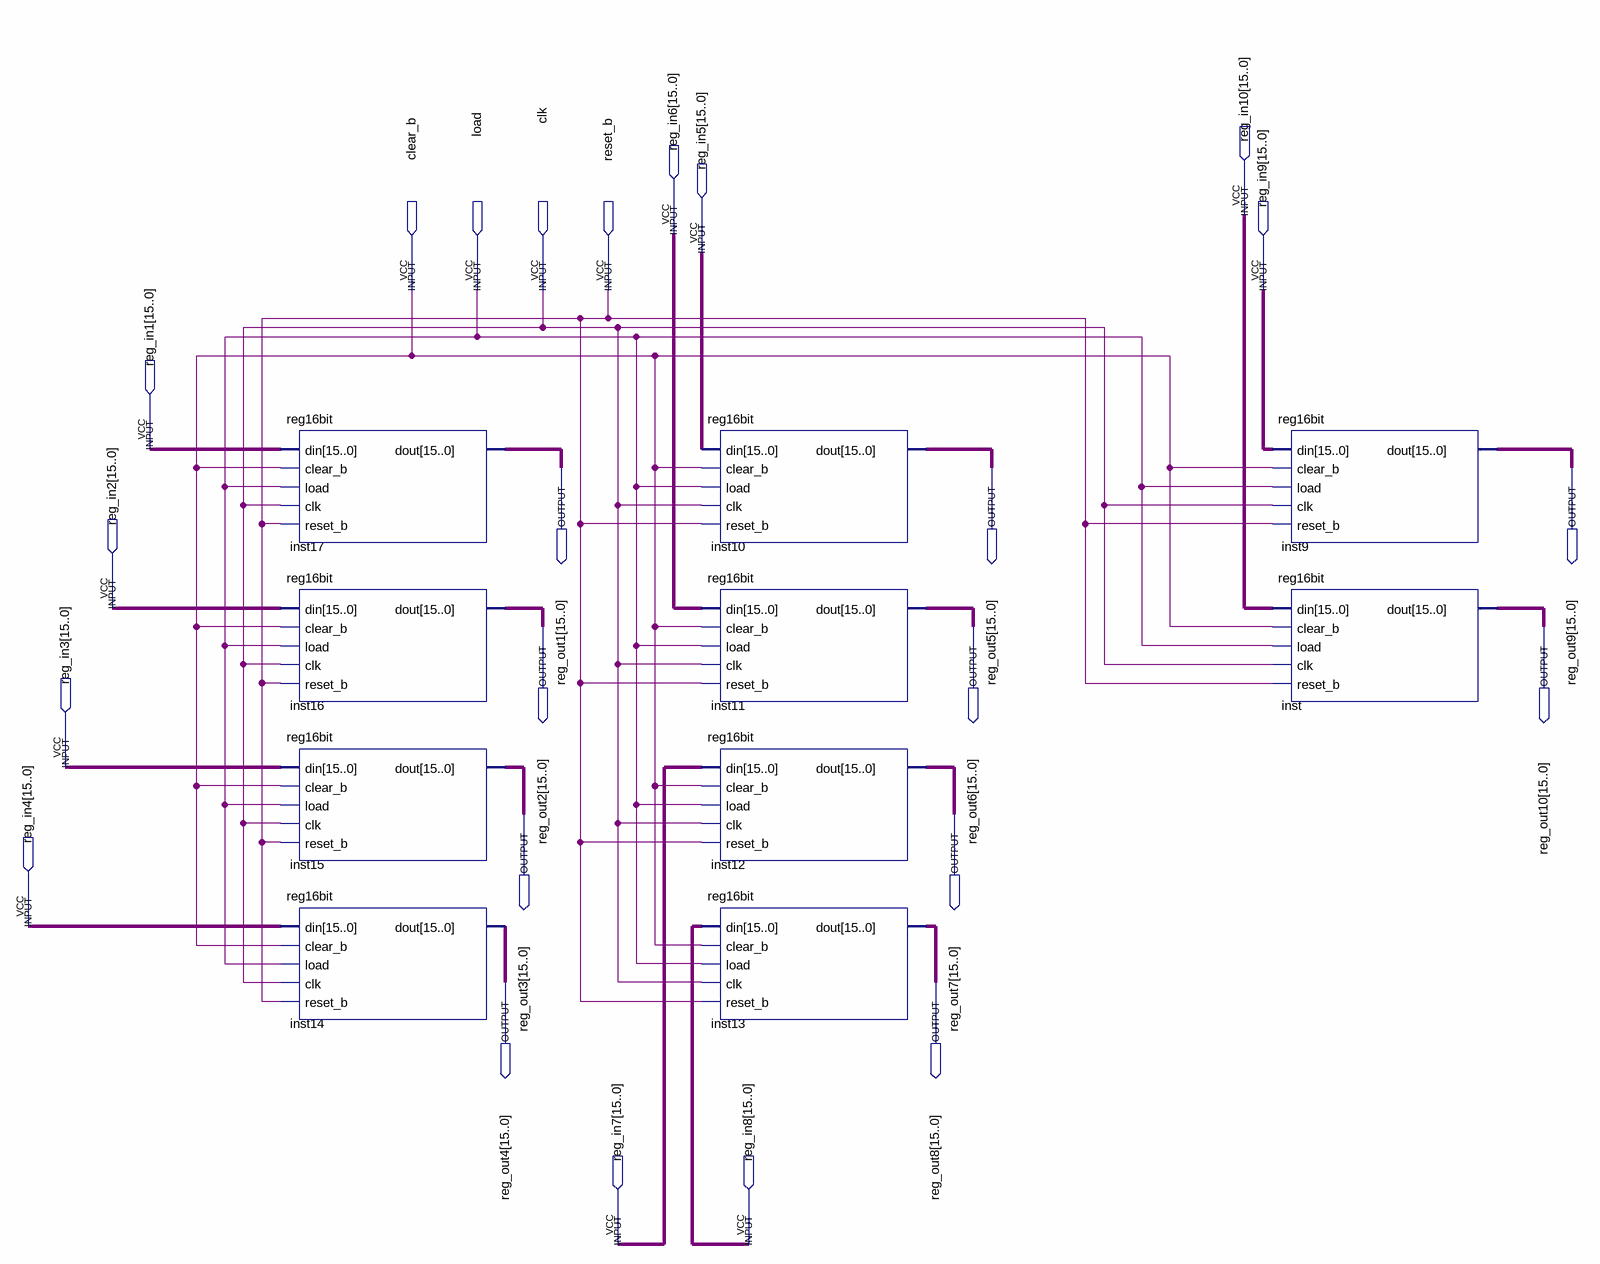
[diagram p0: schematic sheet]
// Quartus schematic reg160bitFinal.bdf as structural Verilog: 10 symbols, 24 pins
module reg160bitFinal (
  input  [15:0] reg_in10,
  input  [15:0] reg_in6,
  input  [15:0] reg_in5,
  input  clear_b,
  input  load,
  input  clk,
  input  reset_b,
  input  [15:0] reg_in9,
  input  [15:0] reg_in1,
  input  [15:0] reg_in2,
  input  [15:0] reg_in3,
  input  [15:0] reg_in4,
  input  [15:0] reg_in7,
  input  [15:0] reg_in8,
  output [15:0] reg_out1,
  output [15:0] reg_out5,
  output [15:0] reg_out9,
  output [15:0] reg_out2,
  output [15:0] reg_out6,
  output [15:0] reg_out10,
  output [15:0] reg_out3,
  output [15:0] reg_out7,
  output [15:0] reg_out4,
  output [15:0] reg_out8
);

  reg16bit inst17 (.din(reg_in1), .clear_b(clear_b), .load(load), .clk(clk), .reset_b(reset_b), .dout(reg_out1));
  reg16bit inst16 (.din(reg_in2), .clear_b(clear_b), .load(load), .clk(clk), .reset_b(reset_b), .dout(reg_out2));
  reg16bit inst15 (.din(reg_in3), .clear_b(clear_b), .load(load), .clk(clk), .reset_b(reset_b), .dout(reg_out3));
  reg16bit inst14 (.din(reg_in4), .clear_b(clear_b), .load(load), .clk(clk), .reset_b(reset_b), .dout(reg_out4));
  reg16bit inst10 (.din(reg_in5), .clear_b(clear_b), .load(load), .clk(clk), .reset_b(reset_b), .dout(reg_out5));
  reg16bit inst11 (.din(reg_in6), .clear_b(clear_b), .load(load), .clk(clk), .reset_b(reset_b), .dout(reg_out6));
  reg16bit inst12 (.din(reg_in7), .clear_b(clear_b), .load(load), .clk(clk), .reset_b(reset_b), .dout(reg_out7));
  reg16bit inst13 (.din(reg_in8), .clear_b(clear_b), .load(load), .clk(clk), .reset_b(reset_b), .dout(reg_out8));
  reg16bit inst9 (.din(reg_in9), .clear_b(clear_b), .load(load), .clk(clk), .reset_b(reset_b), .dout(reg_out9));
  reg16bit inst (.din(reg_in10), .clear_b(clear_b), .load(load), .clk(clk), .reset_b(reset_b), .dout(reg_out10));
endmodule
